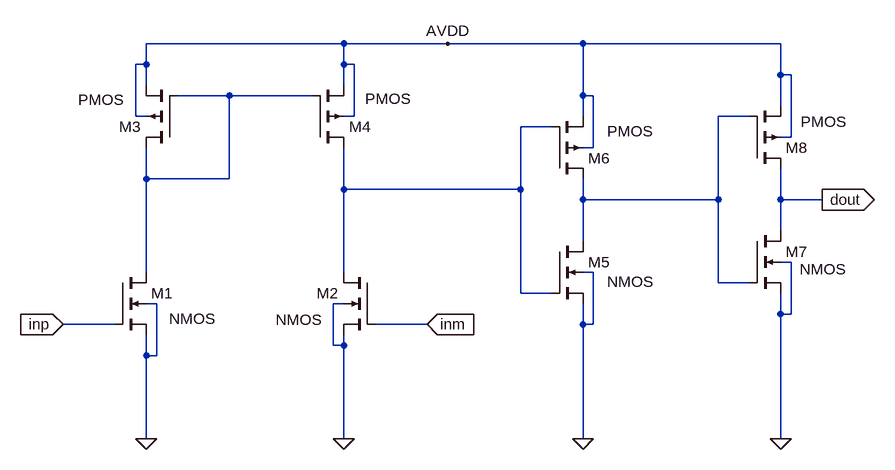
[diagram p0: schematic zc_cmp.asc]
zc_cmp.asc, the LTspice schematic file:
Version 4
SHEET 1 1464 708
WIRE 592 -176 288 -176
WIRE 752 -176 592 -176
WIRE 960 -176 752 -176
WIRE 1264 -176 960 -176
WIRE 288 -144 288 -176
WIRE 288 -144 272 -144
WIRE 592 -144 592 -176
WIRE 608 -144 592 -144
WIRE 1264 -128 1264 -176
WIRE 1280 -128 1264 -128
WIRE 288 -112 288 -144
WIRE 592 -112 592 -144
WIRE 416 -96 336 -96
WIRE 544 -96 416 -96
WIRE 960 -96 960 -176
WIRE 976 -96 960 -96
WIRE 1264 -80 1264 -128
WIRE 272 -64 272 -144
WIRE 288 -64 272 -64
WIRE 608 -64 608 -144
WIRE 608 -64 592 -64
WIRE 960 -64 960 -96
WIRE 1216 -64 1168 -64
WIRE 912 -48 864 -48
WIRE 1280 -32 1280 -128
WIRE 1280 -32 1264 -32
WIRE 976 -16 976 -96
WIRE 976 -16 960 -16
WIRE 288 32 288 -16
WIRE 416 32 416 -96
WIRE 416 32 288 32
WIRE 592 48 592 -16
WIRE 864 48 864 -48
WIRE 864 48 592 48
WIRE 960 64 960 32
WIRE 1168 64 1168 -64
WIRE 1168 64 960 64
WIRE 1264 64 1264 16
WIRE 1328 64 1264 64
WIRE 1264 112 1264 64
WIRE 960 128 960 64
WIRE 1280 160 1264 160
WIRE 288 176 288 32
WIRE 592 176 592 48
WIRE 976 176 960 176
WIRE 1168 192 1168 64
WIRE 1216 192 1168 192
WIRE 864 208 864 48
WIRE 912 208 864 208
WIRE 304 224 288 224
WIRE 592 224 576 224
WIRE 1264 240 1264 208
WIRE 1280 240 1280 160
WIRE 1280 240 1264 240
WIRE 240 256 160 256
WIRE 720 256 640 256
WIRE 960 256 960 224
WIRE 976 256 976 176
WIRE 976 256 960 256
WIRE 576 288 576 224
WIRE 592 288 592 272
WIRE 592 288 576 288
WIRE 288 304 288 272
WIRE 304 304 304 224
WIRE 304 304 288 304
WIRE 288 432 288 304
WIRE 592 432 592 288
WIRE 960 432 960 256
WIRE 1264 432 1264 240
FLAG 288 432 0
FLAG 592 432 0
FLAG 160 256 inp
IOPIN 160 256 In
FLAG 752 -176 AVDD
FLAG 960 432 0
FLAG 1264 432 0
FLAG 1328 64 dout
IOPIN 1328 64 Out
FLAG 720 256 inm
IOPIN 720 256 In
SYMBOL nmos4 240 176 R0
WINDOW 3 83 71 Left 2
SYMATTR InstName M1
SYMBOL pmos4 336 -16 R180
WINDOW 3 82 74 Left 2
SYMATTR InstName M3
SYMBOL nmos4 640 176 M0
WINDOW 3 81 73 Left 2
SYMATTR InstName M2
SYMBOL pmos4 544 -16 M180
WINDOW 3 81 75 Left 2
SYMATTR InstName M4
SYMBOL pmos4 912 32 M180
WINDOW 3 85 73 Left 2
SYMATTR InstName M6
SYMBOL nmos4 912 128 R0
WINDOW 3 85 62 Left 2
SYMATTR InstName M5
SYMBOL pmos4 1216 16 M180
WINDOW 3 79 72 Left 2
SYMATTR InstName M8
SYMBOL nmos4 1216 112 R0
WINDOW 3 77 59 Left 2
SYMATTR InstName M7

The netlist it stands for:
* zc_cmp.asc
M1 N001 inp 0 0 NMOS
M3 N001 N001 AVDD AVDD PMOS
M2 N003 inm 0 0 NMOS
M4 N003 N001 AVDD AVDD PMOS
M6 N002 N003 AVDD AVDD PMOS
M5 N002 N003 0 0 NMOS
M8 dout N002 AVDD AVDD PMOS
M7 dout N002 0 0 NMOS
.model NMOS NMOS
.model PMOS PMOS
.lib standard.mos
.backanno
.end